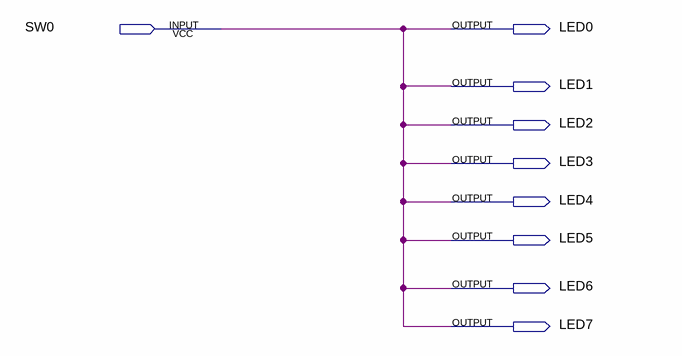
[diagram p0: schematic sheet]
// Quartus schematic test2.bdf as structural Verilog: 0 symbols, 9 pins
module test2 (
  input  SW0,
  output LED0,
  output LED1,
  output LED2,
  output LED3,
  output LED4,
  output LED5,
  output LED6,
  output LED7
);


  assign LED0 = SW0;
  assign LED1 = SW0;
  assign LED2 = SW0;
  assign LED3 = SW0;
  assign LED4 = SW0;
  assign LED5 = SW0;
  assign LED6 = SW0;
  assign LED7 = SW0;
endmodule
